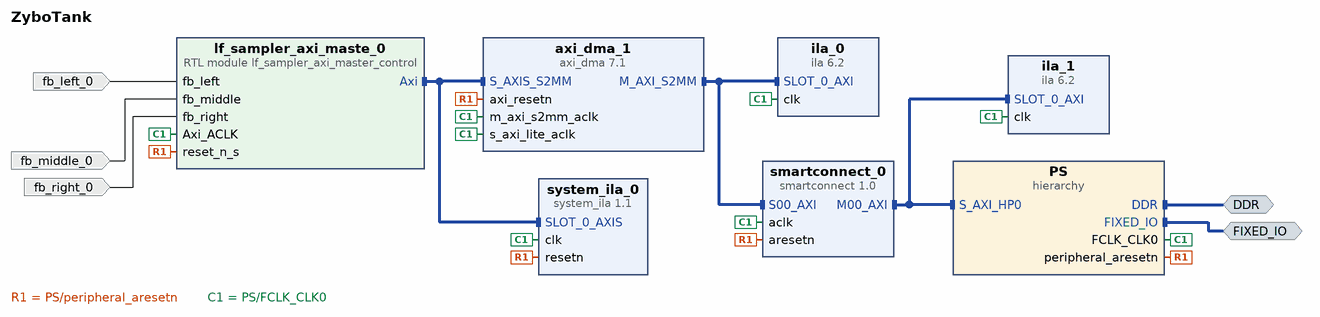
[diagram p0: block diagram of the top level]
# Vivado block design ZyboTank, xc7z020clg400-1, Vivado 2023.1
create_bd_design ZyboTank

create_bd_intf_port -mode Master -vlnv xilinx.com:interface:ddrx_rtl:1.0 DDR
create_bd_intf_port -mode Master -vlnv xilinx.com:display_processing_system7:fixedio_rtl:1.0 FIXED_IO
create_bd_port -dir I fb_right_0
create_bd_port -dir I fb_middle_0
create_bd_port -dir I fb_left_0

create_bd_cell -type hier PS
create_bd_cell -type ip -vlnv xilinx.com:ip:axi_dma:7.1 axi_dma_1
set_property -dict [list \
  CONFIG.c_include_mm2s 0 \
  CONFIG.c_include_sg 0 \
  CONFIG.c_s2mm_burst_size 4 \
  CONFIG.c_sg_length_width 8 \
] [get_bd_cells axi_dma_1]
create_bd_cell -type ip -vlnv xilinx.com:ip:ila:6.2 ila_0
set_property -dict {CONFIG.C_ENABLE_ILA_AXI_MON true CONFIG.C_MONITOR_TYPE AXI CONFIG.C_NUM_OF_PROBES 44} [get_bd_cells ila_0]
create_bd_cell -type ip -vlnv xilinx.com:ip:ila:6.2 ila_1
set_property -dict {CONFIG.C_ENABLE_ILA_AXI_MON true CONFIG.C_MONITOR_TYPE AXI CONFIG.C_NUM_OF_PROBES 45} [get_bd_cells ila_1]
create_bd_cell -type ip -vlnv xilinx.com:ip:smartconnect:1.0 smartconnect_0
set_property -dict {CONFIG.NUM_SI 1} [get_bd_cells smartconnect_0]
create_bd_cell -type ip -vlnv xilinx.com:ip:system_ila:1.1 system_ila_0
set_property -dict [list \
  CONFIG.C_MON_TYPE INTERFACE \
  CONFIG.C_SLOT_0_APC_EN 0 \
  CONFIG.C_SLOT_0_AXI_AR_SEL 0 \
  CONFIG.C_SLOT_0_AXI_AR_SEL_DATA 0 \
  CONFIG.C_SLOT_0_AXI_AR_SEL_TRIG 0 \
  CONFIG.C_SLOT_0_INTF_TYPE xilinx.com:interface:axis_rtl:1.0 \
  CONFIG.C_SLOT_0_TXN_CNTR_EN 0 \
] [get_bd_cells system_ila_0]
create_bd_cell -type module -reference lf_sampler_axi_master_control lf_sampler_axi_maste_0

# ---- hierarchy /PS ----
current_bd_instance /PS
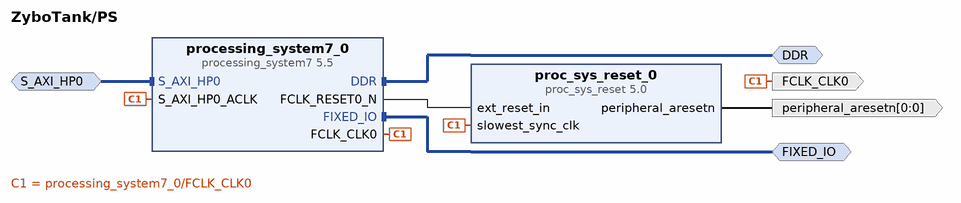
[diagram p1: block diagram inside /PS]
create_bd_intf_pin -mode Master -vlnv xilinx.com:interface:ddrx_rtl:1.0 DDR
create_bd_intf_pin -mode Master -vlnv xilinx.com:display_processing_system7:fixedio_rtl:1.0 FIXED_IO
create_bd_intf_pin -mode Slave -vlnv xilinx.com:interface:aximm_rtl:1.0 S_AXI_HP0
create_bd_pin -dir O -type clk FCLK_CLK0
create_bd_pin -dir O -from 0 -to 0 -type rst peripheral_aresetn

create_bd_cell -type ip -vlnv xilinx.com:ip:proc_sys_reset:5.0 proc_sys_reset_0
create_bd_cell -type ip -vlnv xilinx.com:ip:processing_system7:5.5 processing_system7_0
set_property -dict [list \
  CONFIG.PCW_APU_PERIPHERAL_FREQMHZ 666.666666 \
  CONFIG.PCW_ENET0_PERIPHERAL_ENABLE 0 \
  CONFIG.PCW_FPGA0_PERIPHERAL_FREQMHZ 100 \
  CONFIG.PCW_FPGA1_PERIPHERAL_FREQMHZ 50 \
  CONFIG.PCW_GPIO_MIO_GPIO_ENABLE 0 \
  CONFIG.PCW_PERIPHERAL_BOARD_PRESET None \
  CONFIG.PCW_PRESET_BANK1_VOLTAGE {LVCMOS 3.3V} \
  CONFIG.PCW_QSPI_PERIPHERAL_ENABLE 0 \
  CONFIG.PCW_SD0_PERIPHERAL_ENABLE 0 \
  CONFIG.PCW_UART1_PERIPHERAL_ENABLE 0 \
  CONFIG.PCW_UIPARAM_DDR_FREQ_MHZ 533.333333 \
  CONFIG.PCW_UIPARAM_DDR_PARTNO {MT41J128M8 JP-125} \
  CONFIG.PCW_USB0_PERIPHERAL_ENABLE 0 \
  CONFIG.PCW_USE_M_AXI_GP0 0 \
  CONFIG.PCW_USE_S_AXI_HP0 1 \
] [get_bd_cells processing_system7_0]
# 325 more settings of processing_system7_0 are not shown: defaults, MIO pin electricals, DDR timing, and values the tool derives

# ---- connections ----

current_bd_instance /PS
connect_bd_intf_net [get_bd_intf_pins processing_system7_0/S_AXI_HP0] [get_bd_intf_pins S_AXI_HP0]
connect_bd_intf_net [get_bd_intf_pins DDR] [get_bd_intf_pins processing_system7_0/DDR]
connect_bd_intf_net [get_bd_intf_pins FIXED_IO] [get_bd_intf_pins processing_system7_0/FIXED_IO]
connect_bd_net [get_bd_pins proc_sys_reset_0/peripheral_aresetn] [get_bd_pins peripheral_aresetn]
connect_bd_net [get_bd_pins processing_system7_0/FCLK_CLK0] \
  [get_bd_pins FCLK_CLK0] [get_bd_pins proc_sys_reset_0/slowest_sync_clk] [get_bd_pins processing_system7_0/S_AXI_HP0_ACLK]
connect_bd_net [get_bd_pins processing_system7_0/FCLK_RESET0_N] [get_bd_pins proc_sys_reset_0/ext_reset_in]
set_property PFM.AXI_PORT {S_AXI_HP1 {memport "S_AXI_HP" sptag "" memory "" is_range "false"}} [get_bd_cells processing_system7_0]
set_property PFM.CLOCK {FCLK_CLK0 {id "0" is_default "true" proc_sys_reset "/PS/proc_sys_reset_0" status "fixed" freq_hz "125000000"}} [get_bd_cells processing_system7_0]

current_bd_instance /
connect_bd_intf_net [get_bd_intf_pins axi_dma_1/M_AXI_S2MM] [get_bd_intf_pins smartconnect_0/S00_AXI]
connect_bd_intf_net [get_bd_intf_pins axi_dma_1/M_AXI_S2MM] [get_bd_intf_pins ila_0/SLOT_0_AXI]
connect_bd_intf_net [get_bd_intf_pins lf_sampler_axi_maste_0/Axi] [get_bd_intf_pins axi_dma_1/S_AXIS_S2MM]
connect_bd_intf_net [get_bd_intf_pins lf_sampler_axi_maste_0/Axi] [get_bd_intf_pins system_ila_0/SLOT_0_AXIS]
connect_bd_intf_net -intf_net processing_system7_0_DDR [get_bd_intf_ports DDR] [get_bd_intf_pins PS/DDR]
connect_bd_intf_net -intf_net processing_system7_0_FIXED_IO [get_bd_intf_ports FIXED_IO] [get_bd_intf_pins PS/FIXED_IO]
connect_bd_intf_net [get_bd_intf_pins smartconnect_0/M00_AXI] [get_bd_intf_pins PS/S_AXI_HP0]
connect_bd_intf_net [get_bd_intf_pins smartconnect_0/M00_AXI] [get_bd_intf_pins ila_1/SLOT_0_AXI]
connect_bd_net -net fb_left_0_1 [get_bd_ports fb_left_0] [get_bd_pins lf_sampler_axi_maste_0/fb_left]
connect_bd_net -net fb_middle_0_1 [get_bd_ports fb_middle_0] [get_bd_pins lf_sampler_axi_maste_0/fb_middle]
connect_bd_net -net fb_right_0_1 [get_bd_ports fb_right_0] [get_bd_pins lf_sampler_axi_maste_0/fb_right]
connect_bd_net -net proc_sys_reset_0_peripheral_aresetn [get_bd_pins PS/peripheral_aresetn] \
  [get_bd_pins axi_dma_1/axi_resetn] [get_bd_pins smartconnect_0/aresetn] [get_bd_pins system_ila_0/resetn] \
  [get_bd_pins lf_sampler_axi_maste_0/reset_n_s]
connect_bd_net -net processing_system7_0_FCLK_CLK0 [get_bd_pins PS/FCLK_CLK0] \
  [get_bd_pins axi_dma_1/s_axi_lite_aclk] [get_bd_pins axi_dma_1/m_axi_s2mm_aclk] [get_bd_pins ila_0/clk] \
  [get_bd_pins ila_1/clk] [get_bd_pins smartconnect_0/aclk] [get_bd_pins system_ila_0/clk] \
  [get_bd_pins lf_sampler_axi_maste_0/Axi_ACLK]
set_property PFM.AXI_PORT {M01_AXI {memport "M_AXI_GP" sptag "" memory "" is_range "true"}} [get_bd_cells smartconnect_0]

# ---- address map ----
assign_bd_address -offset 0x00000000 -range 512M -target_address_space [get_bd_addr_spaces axi_dma_1/Data_S2MM] [get_bd_addr_segs PS/processing_system7_0/S_AXI_HP0/HP0_DDR_LOWOCM]

validate_bd_design
save_bd_design
